# EAGLE design PCB (EAGLE 9.6.2)
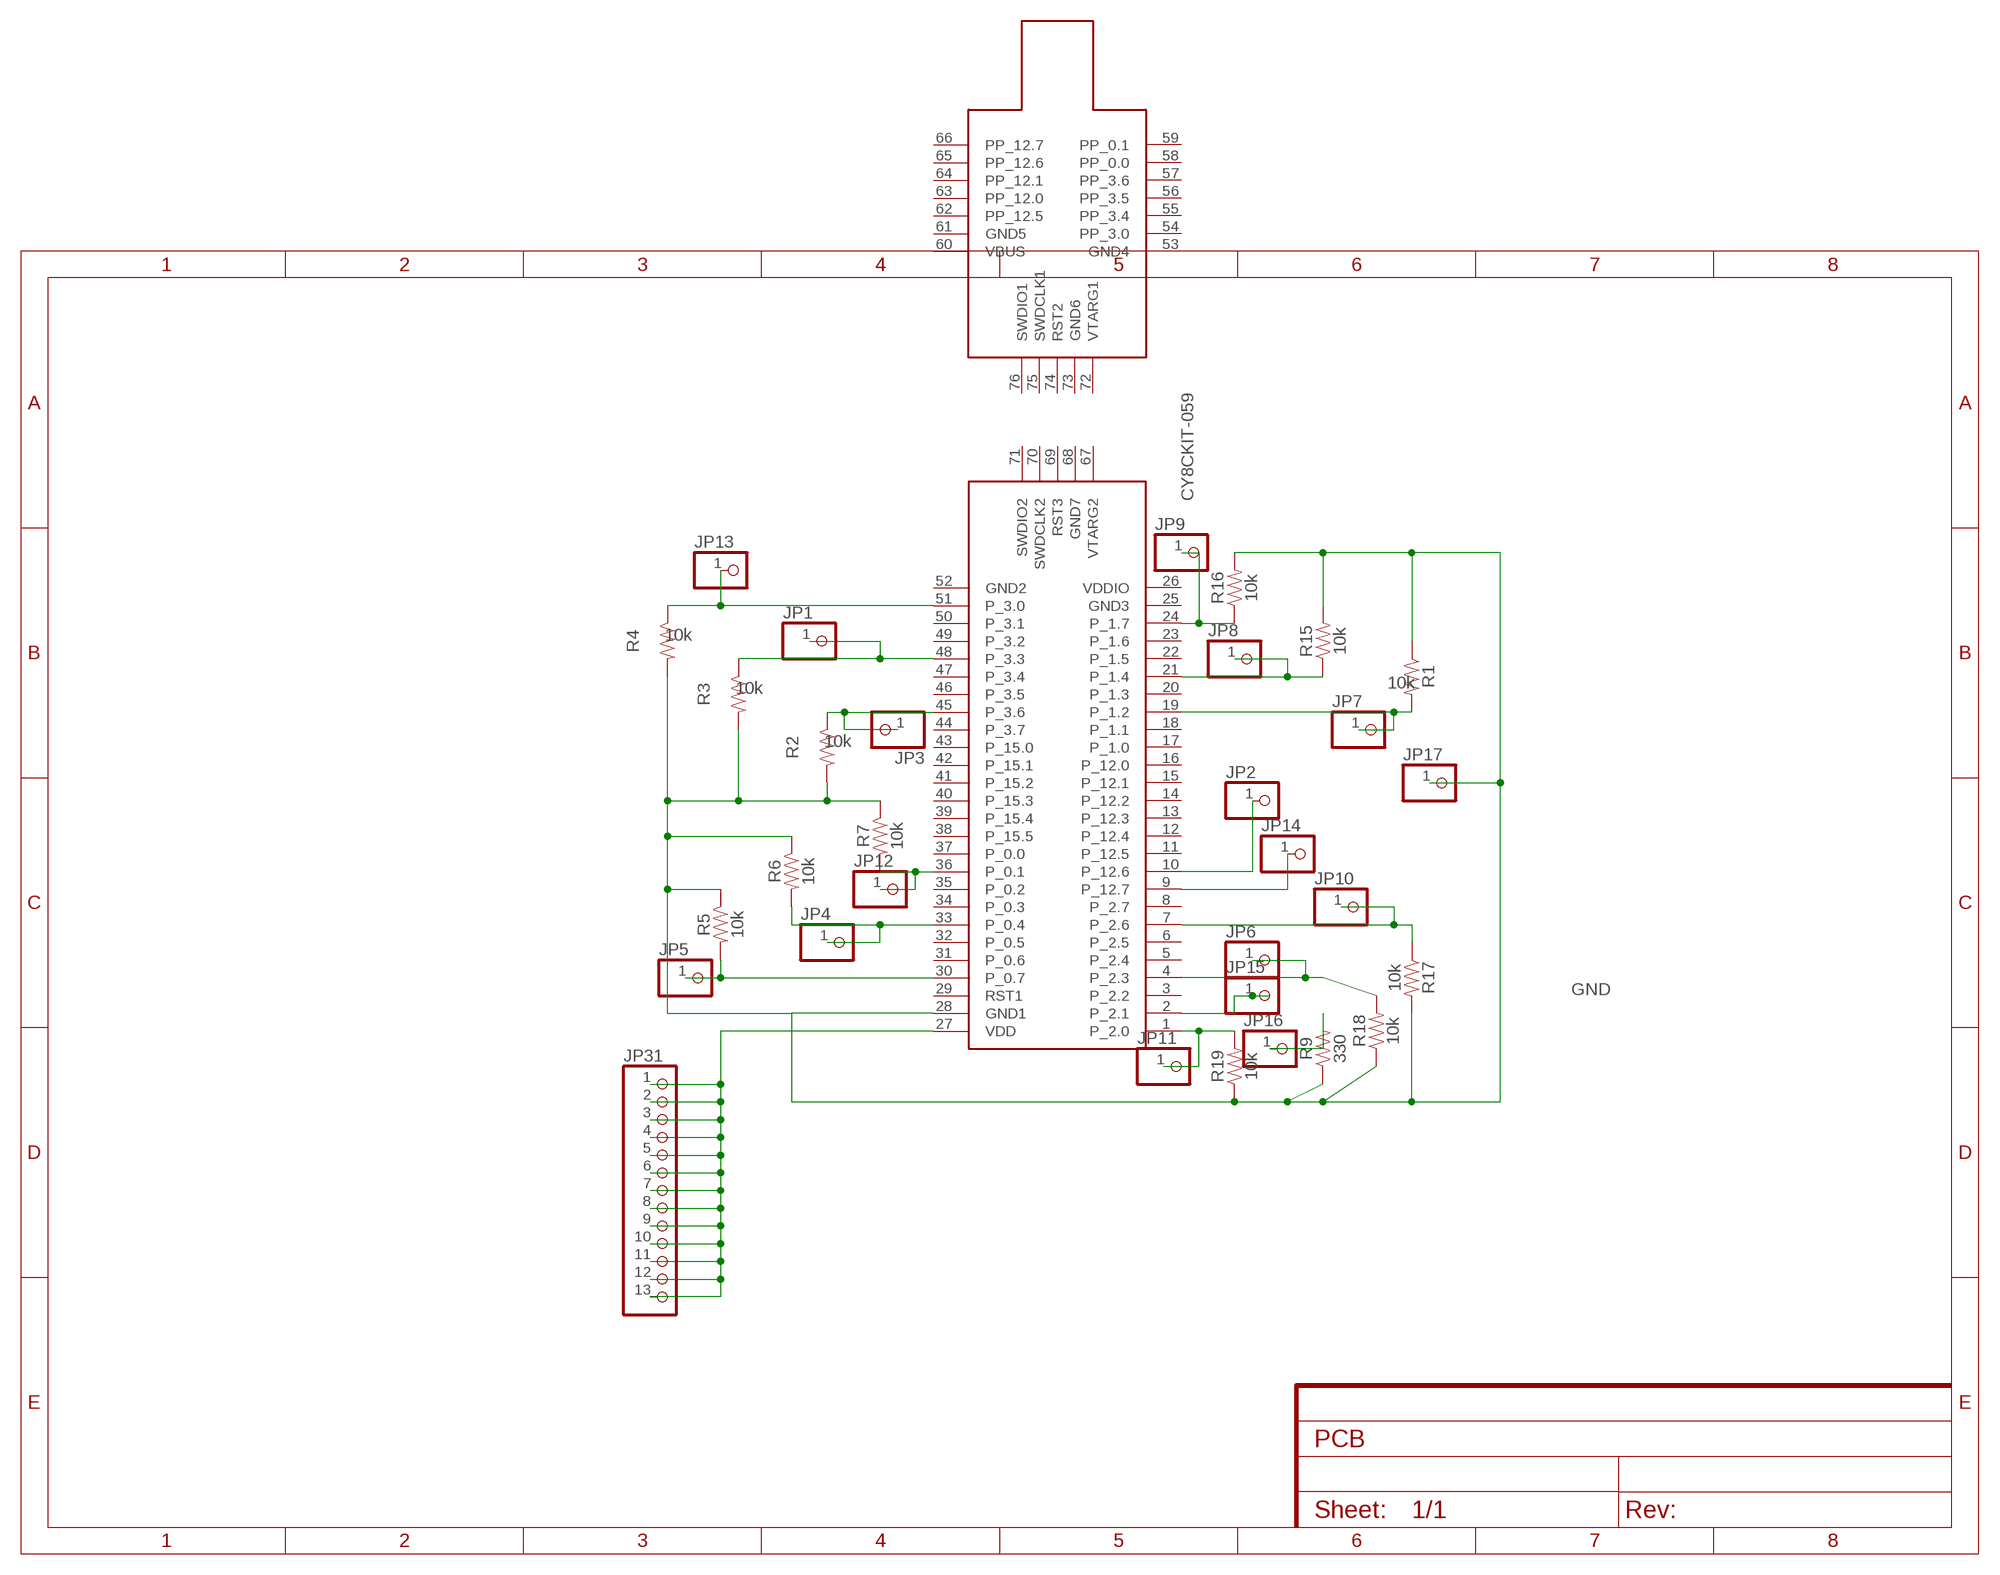
[diagram p0: schematic, sheet 1]

## Parts
JP1  PINHD-1X1  [1X01]
JP2  PINHD-1X1  [1X01]
JP3  PINHD-1X1  [1X01]
JP4  PINHD-1X1  [1X01]
JP5  PINHD-1X1  [1X01]
JP6  PINHD-1X1  [1X01]
JP7  PINHD-1X1  [1X01]
JP8  PINHD-1X1  [1X01]
JP9  PINHD-1X1  [1X01]
JP10  PINHD-1X1  [1X01]
JP11  PINHD-1X1  [1X01]
JP12  PINHD-1X1  [1X01]
JP13  PINHD-1X1  [1X01]
JP14  PINHD-1X1  [1X01]
JP15  PINHD-1X1  [1X01]
JP16  PINHD-1X1  [1X01]
JP17  PINHD-1X1  [1X01]
JP31  PINHD-1X13  [1X13]
R1  10k  10KOHM-HORIZ-1/4W-1%  [AXIAL-0.3]
R2  10k  10KOHM-HORIZ-1/4W-1%  [AXIAL-0.3]
R3  10k  10KOHM-HORIZ-1/4W-1%  [AXIAL-0.3]
R4  10k  10KOHM-HORIZ-1/4W-1%  [AXIAL-0.3]
R5  10k  10KOHM-HORIZ-1/4W-1%  [AXIAL-0.3]
R6  10k  10KOHM-HORIZ-1/4W-1%  [AXIAL-0.3]
R7  10k  10KOHM-HORIZ-1/4W-1%  [AXIAL-0.3]
R9  330  330OHM-HORIZ-1/10W-5%  [AXIAL-0.3]
R15  10k  10KOHM-HORIZ-1/4W-1%  [AXIAL-0.3]
R16  10k  10KOHM-HORIZ-1/4W-1%  [AXIAL-0.3]
R17  10k  10KOHM-HORIZ-1/4W-1%  [AXIAL-0.3]
R18  10k  10KOHM-HORIZ-1/4W-1%  [AXIAL-0.3]
R19  10k  10KOHM-HORIZ-1/4W-1%  [AXIAL-0.3]
U$1  CY8CKIT-059  [CY8CKIT-059]

## Nets
GND: JP17.1 R1.P$1 R2.P$2 R3.P$2 R4.P$2 R5.P$1 R6.P$1 R7.P$1 R9.P$1 R15.P$2 R16.P$2 R17.P$2 R18.P$1 R19.P$1 U$1.28(GND1)
N$1: JP3.1 R2.P$1 U$1.45(P_3.6)
N$2: JP4.1 R6.P$2 U$1.33(P_0.4)
N$3: JP12.1 R7.P$2 U$1.36(P_0.1)
N$4: JP5.1 R5.P$2 U$1.30(P_0.7)
N$5: JP1.1 R3.P$1 U$1.48(P_3.3)
N$6: JP9.1 R16.P$1 U$1.24(P_1.7)
N$7: JP8.1 R15.P$1 U$1.21(P_1.4)
N$8: JP7.1 R1.P$2 U$1.19(P_1.2)
N$9: JP13.1 R4.P$1 U$1.51(P_3.0)
N$10: JP11.1 R19.P$2 U$1.1(P_2.0)
N$11: JP6.1 R18.P$2 U$1.4(P_2.3)
N$12: JP10.1 R17.P$1 U$1.7(P_2.6)
N$13: JP2.1 U$1.10(P_12.6)
N$14: JP15.1 U$1.2(P_2.1)
N$15: JP16.1 R9.P$2
N$16: JP14.1 U$1.9(P_12.7)
N$17: JP31.1 JP31.2 JP31.3 JP31.4 JP31.5 JP31.6 JP31.7 JP31.8 JP31.9 JP31.10 JP31.11 JP31.12 JP31.13 U$1.27(VDD)
Unconnected: U$1.3(P_2.2) U$1.5(P_2.4) U$1.6(P_2.5) U$1.8(P_2.7) U$1.11(P_12.5) U$1.12(P_12.4) U$1.13(P_12.3) U$1.14(P_12.2) U$1.15(P_12.1) U$1.16(P_12.0) U$1.17(P_1.0) U$1.18(P_1.1) U$1.20(P_1.3) U$1.22(P_1.5) U$1.23(P_1.6) U$1.25(GND3) U$1.26(VDDIO) U$1.29(RST1) U$1.31(P_0.6) U$1.32(P_0.5) U$1.34(P_0.3) U$1.35(P_0.2) U$1.37(P_0.0) U$1.38(P_15.5) U$1.39(P_15.4) U$1.40(P_15.3) U$1.41(P_15.2) U$1.42(P_15.1) U$1.43(P_15.0) U$1.44(P_3.7) U$1.46(P_3.5) U$1.47(P_3.4) U$1.49(P_3.2) U$1.50(P_3.1) U$1.52(GND2) U$1.53(GND4) U$1.54(PP_3.0) U$1.55(PP_3.4) U$1.56(PP_3.5) U$1.57(PP_3.6) U$1.58(PP_0.0) U$1.59(PP_0.1) U$1.60(VBUS) U$1.61(GND5) U$1.62(PP_12.5) U$1.63(PP_12.0) U$1.64(PP_12.1) U$1.65(PP_12.6) U$1.66(PP_12.7) U$1.67(VTARG2) U$1.68(GND7) U$1.69(RST3) U$1.70(SWDCLK2) U$1.71(SWDIO2) U$1.72(VTARG1) U$1.73(GND6) U$1.74(RST2) U$1.75(SWDCLK1) U$1.76(SWDIO1)

## Library data of the parts
JP1-JP17 = pinhead:PINHD-1X1: PIN HEADER
JP31 = pinhead:PINHD-1X13: PIN HEADER
R1-R7 R15-R19 = SparkFun-Resistors:10KOHM: 10kΩ resistor A resistor is a passive two-terminal electrical component that implements electrical resistance as a circuit element. Resistors act to reduce current flow, and, at the same time, act to lower voltage levels within circuits. - Wikipedia; PROD_ID: RES-12183
R9 = SparkFun-Resistors:330OHM: 330Ω resistor A resistor is a passive two-terminal electrical component that implements electrical resistance as a circuit element. Resistors act to reduce current flow, and, at the same time, act to lower voltage levels within circuits. - Wikipedia; PROD_ID: RES-8371
U$1 = CY8KIT-059:CY8CKIT-059: Complete CY8CKIT-059 Device This is the complete footprint of the CY8CKIT-059 kit. It offers you the possibility to solder all the pins of the Kit on your PCB.

## Board
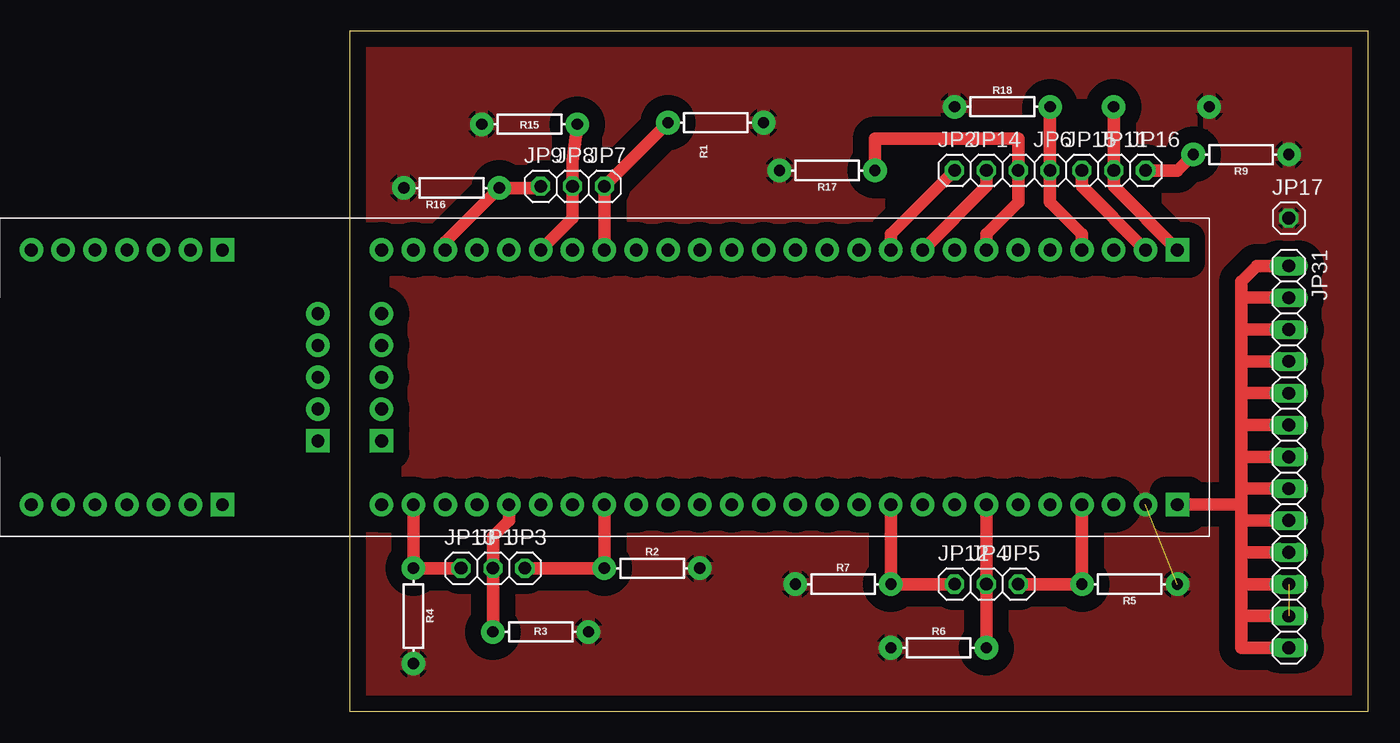
[diagram p1: board, top side]
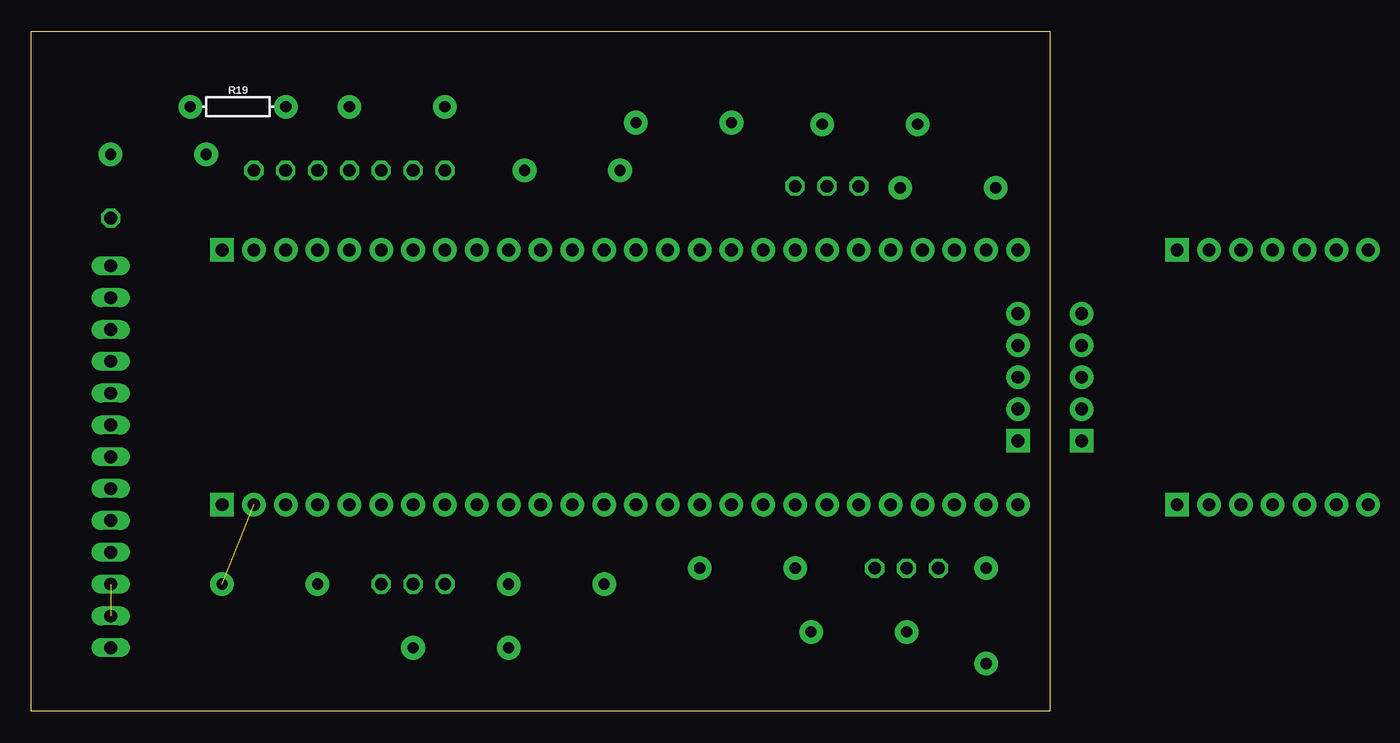
[diagram p2: board, bottom side, seen from below]

Size 81.26 x 54.28 mm. Coordinates in mm from the lower left corner, seen from the top.
Outline: 0,0 81.26,0 81.26,54.28 0,54.28 0,0
Copper layers (1*16): Top 0.035mm / dielectric 1.5mm / Bottom 0.035mm
Design rules "default": minimum track width 6mil, minimum drill 0.35mm, track to track 6mil, track to pad 6mil, pad to pad 6mil, via to via 6mil, smd to smd 6mil, copper to edge 40mil, drill to drill 6mil, minimum pad ring 10mil, minimum via ring 8mil, stop-mask expansion 4mil, vias tented up to drill 0mil, thermal gap 10mil

### Footprints (pad centres in the part's own frame; a part is rotated, then mirrored left to right if it is on the bottom)
1X01 = drill 1.016 octagon: 1 0,0
1X13 = drill 1.016 long: 1 -15.24,0; 2 -12.7,0; 3 -10.16,0; 4 -7.62,0; 5 -5.08,0; 6 -2.54,0; 7 0,0; 8 2.54,0; 9 5.08,0; 10 7.62,0; 11 10.16,0; 12 12.7,0; 13 15.24,0
AXIAL-0.3 = drill 0.9 pad 1.88: P$1 -3.81,0; P$2 3.81,0
CY8CKIT-059 = drill 1.016 pad 1.876 square: 1 30.48,8.89; 27 30.48,-11.43; 53 -45.72,8.89; 60 -45.72,-11.43; 71 -33.02,-6.35; 76 -38.1,-6.35 | drill 1.016 pad 1.876: 2 27.94,8.89; 3 25.4,8.89; 4 22.86,8.89; 5 20.32,8.89; 6 17.78,8.89; 7 15.24,8.89; 8 12.7,8.89; 9 10.16,8.89; 10 7.62,8.89; 11 5.08,8.89; 12 2.54,8.89; 13 0,8.89; 14 -2.54,8.89; 15 -5.08,8.89; 16 -7.62,8.89; 17 -10.16,8.89; 18 -12.7,8.89; 19 -15.24,8.89; 20 -17.78,8.89; 21 -20.32,8.89; 22 -22.86,8.89; 23 -25.4,8.89; 24 -27.94,8.89; 25 -30.48,8.89; 26 -33.02,8.89; 28 27.94,-11.43; 29 25.4,-11.43; 30 22.86,-11.43; 31 20.32,-11.43; 32 17.78,-11.43; 33 15.24,-11.43; 34 12.7,-11.43; 35 10.16,-11.43; 36 7.62,-11.43; 37 5.08,-11.43; 38 2.54,-11.43; 39 0,-11.43; 40 -2.54,-11.43; 41 -5.08,-11.43; 42 -7.62,-11.43; 43 -10.16,-11.43; 44 -12.7,-11.43; 45 -15.24,-11.43; 46 -17.78,-11.43; 47 -20.32,-11.43; 48 -22.86,-11.43; 49 -25.4,-11.43; 50 -27.94,-11.43; 51 -30.48,-11.43; 52 -33.02,-11.43; 54 -48.26,8.89; 55 -50.8,8.89; 56 -53.34,8.89; 57 -55.88,8.89; 58 -58.42,8.89; 59 -60.96,8.89; 61 -48.26,-11.43; 62 -50.8,-11.43; 63 -53.34,-11.43; 64 -55.88,-11.43; 65 -58.42,-11.43; 66 -60.96,-11.43; 67 -33.02,3.81; 68 -33.02,1.27; 69 -33.02,-1.27; 70 -33.02,-3.81; 72 -38.1,3.81; 73 -38.1,1.27; 74 -38.1,-1.27; 75 -38.1,-3.81

### Placement (x,y rotation side)
JP1  11.43,11.43 0 top
JP2  48.26,43.18 0 top
JP3  13.97,11.43 0 top
JP4  50.8,10.16 0 top
JP5  53.34,10.16 0 top
JP6  55.88,43.18 0 top
JP7  20.32,41.91 0 top
JP8  17.78,41.91 0 top
JP9  15.24,41.91 0 top
JP10  53.34,43.18 0 top
JP11  60.96,43.18 0 top
JP12  48.26,10.16 0 top
JP13  8.89,11.43 0 top
JP14  50.8,43.18 0 top
JP15  58.42,43.18 0 top
JP16  63.5,43.18 0 top
JP17  74.93,39.37 0 top
JP31  74.93,20.32 270 top
R1  29.21,46.99 180 top
R2  24.13,11.43 0 top
R3  15.24,6.35 0 top
R4  5.08,7.62 270 top
R5  62.23,10.16 180 top
R6  46.99,5.08 0 top
R7  39.37,10.16 0 top
R9  71.12,44.45 180 top
R15  14.35,46.86 180 top
R16  8.13,41.78 180 top
R17  38.1,43.18 180 top
R18  52.07,48.26 0 top
R19  64.77,48.26 0 bottom
U$1  35.56,27.94 0 top

### Tracks (layer width: path | path; a pad name or v marks a point on that pad's centre or on a via)
GND  (1 unrouted)
  pour Top (isolate 1.27): 0,0 0,54.61 81.28,54.61 81.28,0
N$1
  Top 1: U$1.45 R2.P$1 JP3.1
N$2
  Top 1: U$1.33 JP4.1 R6.P$2
N$3
  Top 1: JP12.1 R7.P$2 U$1.36
N$4
  Top 1: JP5.1 R5.P$2 U$1.30
N$5
  Top 1: R3.P$1 JP1.1 11.43,13.97 12.7,15.24 U$1.48
N$6
  Top 1: JP9.1 15.11,41.78 R16.P$1 7.62,37.47 U$1.24
N$7
  Top 1: U$1.21 17.78,39.37 JP8.1 17.78,43.94 R15.P$1
N$8
  Top 1: U$1.19 JP7.1 R1.P$2
N$9
  Top 1: U$1.51 R4.P$1 JP13.1
N$10
  Top 1: U$1.1 60.96,41.91 JP11.1 R19.P$2
N$11
  Top 1: U$1.4 58.42,38.1 55.88,40.64 JP6.1 R18.P$2
N$12
  Top 1: R17.P$1 41.91,45.72 53.34,45.72 JP10.1 53.34,40.64 50.8,38.1 U$1.7
N$13
  Top 1: JP2.1 43.18,38.1 U$1.10
N$14
  Top 1: JP15.1 58.42,41.91 U$1.2
N$15
  Top 1: R9.P$2 66.04,43.18 JP16.1
N$16
  Top 1: JP14.1 50.8,41.91 U$1.9
N$17  (1 unrouted)
  Top 1: 71.12,20.32 71.12,22.86 | 71.12,22.86 71.12,25.4 | 71.12,25.4 71.12,27.94 | 71.12,27.94 71.12,30.48 | 71.12,30.48 71.12,33.02 | 71.12,33.02 71.12,34.29 72.39,35.56 JP31.1 | JP31.2 71.12,33.02 | JP31.3 71.12,30.48 | JP31.4 71.12,27.94 | JP31.5 71.12,25.4 | JP31.6 71.12,22.86 | JP31.7 71.12,20.32 | JP31.8 71.12,17.78 | U$1.27 71.12,16.51 | 71.12,16.51 71.12,17.78 | 71.12,17.78 71.12,20.32 | JP31.9 71.12,15.24 | 71.12,16.51 71.12,15.24 | 71.12,15.24 71.12,12.7 | 71.12,12.7 71.12,10.16 | 71.12,10.16 71.12,5.08 JP31.13 | JP31.12 71.12,7.62 | JP31.11 71.12,10.16 | JP31.10 71.12,12.7